# Altium schematic sheet balancing.SchDoc
size A; SheetNumber: 2; SheetTotal: 2
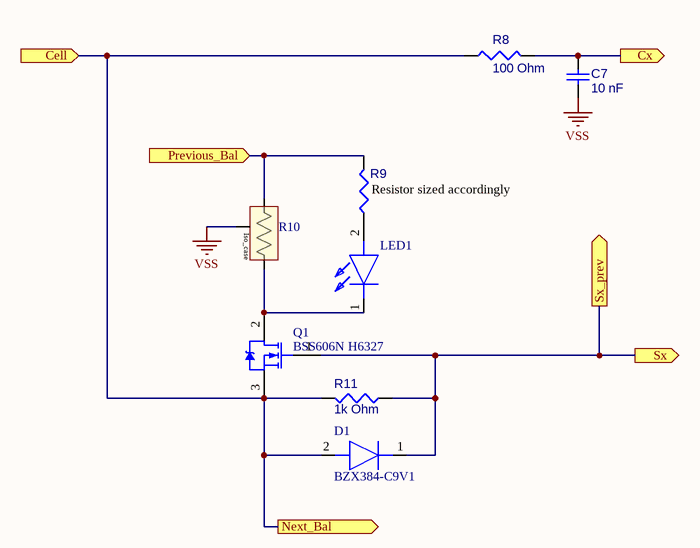
[diagram p0: balancing.SchDoc]

## Parts
C7  10 nF  [CAPC2012X14M]
D1  BZX384-C9V1  [SOD2512X110N]
LED1  LS_R976-NR-1  [LEDC2012X40N]  (value not drawn)
Q1  BSS606N H6327  [INF-PG-SOT-89_N]
R8  100 Ohm  [RESC2012X06M]
R9  (no value)  [RESC2012X06M]
R10  DTO025C2R200JTE3  [RES_DTO025_VIS-M]  (value not drawn)
R11  1k Ohm  [RESC2012X06M]

## Ports
Cell (in, see slave_schematic[3C]), Cx (out, see slave_schematic[4C]), Next_Bal (out, see slave_schematic[3C]), Previous_Bal (in, see slave_schematic[3C]), Sx (out, see slave_schematic[4C]), Sx_prev (out, see slave_schematic[4C])

## Nets
VSS: C7.2 R10.3
Cell: D1.2(A) Q1.3(S) R8.1 R11.2 ; port Cell, port Next_Bal
Cx: C7.1 R8.2 ; port Cx
Previous_Bal: R9.2 R10.2 ; port Previous_Bal
Sx: D1.1(K) Q1.1(G) R11.1 ; port Sx, port Sx_prev
NetLED1_1: LED1.1(K) Q1.2(D) R10.1
NetLED1_2: LED1.2(A) R9.1

## Notes on the sheet
- (near R9) Resistor sized accordingly
- (in symbol CMP-009-00181-9) Iso_case

## Library data of the parts
C7 = CMP-001-00083-4: 0805_generic_capacitor
D1 = BZX384-C9V1: Diode; Manufacturer_Name: Nexperia; Datasheet Link: https://datasheet.datasheetarchive.com/originals/distributors/Datasheets-301/11577.pdf; Height: 1.1mm; Manufacturer_Part_Number: BZX384-C9V1
LED1 = LS_R976-NR-1: LED; Manufacturer_Name: ams OSRAM; Manufacturer_Part_Number: LS R976-NR-1; Datasheet Link: https://datasheet.datasheetarchive.com/originals/distributors/DKDS-18/344792.pdf; Height: 0.4mm; Mouser Part Number: 720-LSR976-NR-1; Mouser Price/Stock: https://www.mouser.co.uk/ProductDetail/ams-OSRAM/LS-R976-NR-1?qs=K5ta8V%252BWhtZhvCAe1sTZFg%3D%3D; Arrow Part Number: LS R976-NR-1; Arrow Price/Stock: https://www.arrow.com/en/products/lsr976-nr-1/osram-opto-semiconductors
Q1 = CMP-1149-00049-1: OptiMOS-3 Small-Signal-Transistor, 60 V VDS, 3.2 A ID, PG-SOT-89, Reel, Green; Manufacturer: Infineon; VDS (max): 60 V; Green: TRUE; RDS (on) (max): 60 mOhm; Polarity: N; ID (max): 3.2Â A; PackageDescription: 3-Pin Small Outline Transistor Package, 4.5 x 2.5 mm Body, 1.5 mm Pitch; ComponentLink1URL: http://www.infineon.com/; PackageReference: PG-SOT-89; Halogen-free: TRUE; RevisionNote: Lost Devices pt2; Packing: Reel; ComponentLink3URL: http://www.infineon.com/cms/packages/SMD_-_Surface_Mounted_Devices/SOT/SOT089_xSC62x.html?__locale=en; ComponentLink1Description: Manufacturer URL; PartNumber: BSS606N H6327; DatasheetVersion: Rev. 2.2; ComponentLink2Description: Datasheet; Mounting Technology: Surface Mount; PackageVersion: Apr-08; ComponentLink2URL: http://www.infineon.com/dgdl/BSS606N_2.2.pdf?folderId=db3a3043156fd573011622e10b5c1f67&fileId=db3a30433dfcb54c013dfd4f43ed0120; ComponentLink3Description: Package Specification
R8 R9 R11 = CMP-009-00178-2: 805_generic_resistor
R10 = CMP-009-00181-9: Description; Manufacturer_Name: Vishay; Copyright: Copyright (C) 2026 Ultra Librarian. All rights reserved.; Manufacturer_Part_Number: DTO025C2R200JTE3; Pins: 3; Design Item ID: DTO025C2R200JTE3; Component Type: Standard; Source: DTO025C2R200JTE3.SchLib